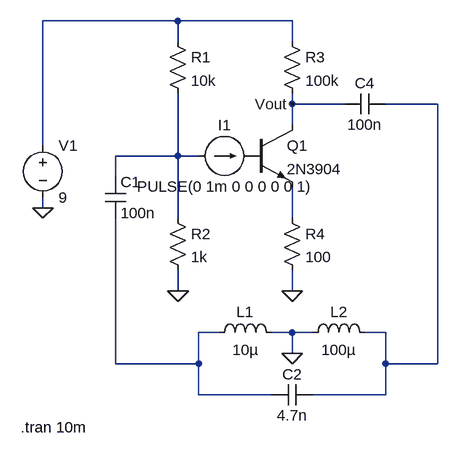
[diagram p0: schematic hartley_osc.asc]
hartley_osc.asc, the LTspice schematic file:
Version 4
SHEET 1 880 680
WIRE 352 -48 144 -48
WIRE 528 -48 352 -48
WIRE 352 -16 352 -48
WIRE 528 -16 528 -48
WIRE 528 80 528 64
WIRE 608 80 528 80
WIRE 752 80 672 80
WIRE 528 112 528 80
WIRE 144 144 144 -48
WIRE 352 160 352 64
WIRE 352 160 256 160
WIRE 384 160 352 160
WIRE 256 192 256 160
WIRE 144 240 144 224
WIRE 352 256 352 160
WIRE 528 256 528 208
WIRE 352 368 352 336
WIRE 528 368 528 336
WIRE 416 432 384 432
WIRE 528 432 496 432
WIRE 560 432 528 432
WIRE 672 432 640 432
WIRE 528 464 528 432
WIRE 256 480 256 256
WIRE 384 480 384 432
WIRE 384 480 256 480
WIRE 672 480 672 432
WIRE 752 480 752 80
WIRE 752 480 672 480
WIRE 384 528 384 480
WIRE 496 528 384 528
WIRE 672 528 672 480
WIRE 672 528 560 528
FLAG 144 240 0
FLAG 528 80 Vout
FLAG 352 368 0
FLAG 528 368 0
FLAG 528 464 0
SYMBOL voltage 144 128 R0
WINDOW 123 0 0 Left 0
WINDOW 39 0 0 Left 0
SYMATTR InstName V1
SYMATTR Value 9
SYMBOL res 336 -32 R0
SYMATTR InstName R1
SYMATTR Value 10k
SYMBOL res 336 240 R0
SYMATTR InstName R2
SYMATTR Value 1k
SYMBOL cap 240 192 R0
SYMATTR InstName C1
SYMATTR Value 100n
SYMBOL res 512 240 R0
SYMATTR InstName R4
SYMATTR Value 100
SYMBOL npn 464 112 R0
SYMATTR InstName Q1
SYMATTR Value 2N3904
SYMBOL cap 672 64 R90
WINDOW 0 0 32 VBottom 2
WINDOW 3 32 32 VTop 2
SYMATTR InstName C4
SYMATTR Value 100n
SYMBOL ind 400 448 R270
WINDOW 0 32 56 VTop 2
WINDOW 3 5 56 VBottom 2
SYMATTR InstName L1
SYMATTR Value 10µ
SYMBOL ind 544 448 R270
WINDOW 0 32 56 VTop 2
WINDOW 3 5 56 VBottom 2
SYMATTR InstName L2
SYMATTR Value 100µ
SYMBOL cap 560 512 R90
WINDOW 0 0 32 VBottom 2
WINDOW 3 32 32 VTop 2
SYMATTR InstName C2
SYMATTR Value 4.7n
SYMBOL current 384 160 R270
WINDOW 0 32 40 VTop 2
WINDOW 3 -32 40 VBottom 2
WINDOW 123 0 0 Left 0
WINDOW 39 0 0 Left 0
SYMATTR InstName I1
SYMATTR Value PULSE(0 1m 0 0 0 0 0 1)
SYMBOL res 512 -32 R0
SYMATTR InstName R3
SYMATTR Value 100k
TEXT 110 578 Left 2 !.tran 10m

The netlist it stands for:
* hartley_osc.asc
V1 N001 0 9
R1 N001 N003 10k
R2 N003 0 1k
C1 N003 N005 100n
R4 N004 0 100
Q1 Vout P001 N004 0 2N3904
C4 N002 Vout 100n
L1 N005 0 10µ
L2 0 N002 100µ
C2 N002 N005 4.7n
I1 N003 P001 PULSE(0 1m 0 0 0 0 0 1)
R3 N001 Vout 100k
.model NPN NPN
.model PNP PNP
.lib standard.bjt
.tran 10m
.backanno
.end